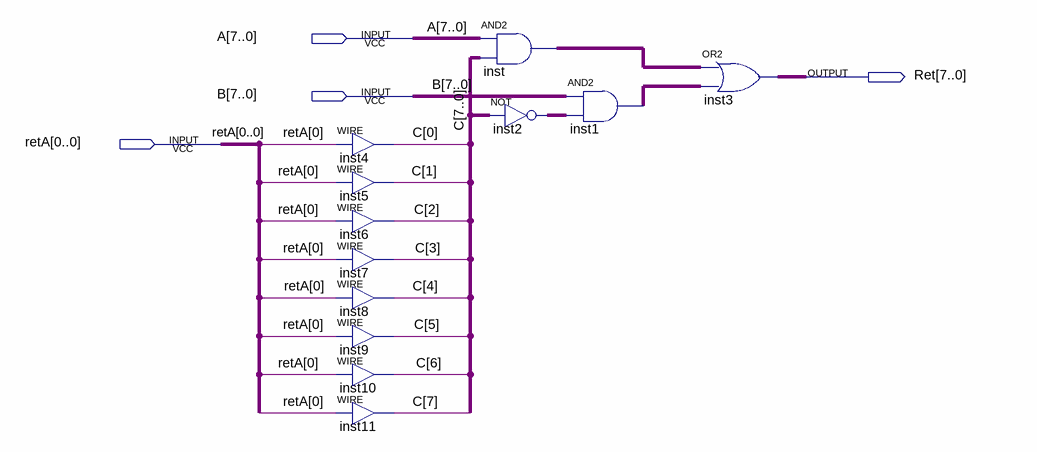
[diagram p0: schematic sheet]
// Quartus schematic multiplex_8.bdf as structural Verilog: 12 symbols, 4 pins
module multiplex_8 (
  input  [7:0] A,
  input  [7:0] B,
  input  [0:0] retA,
  output [7:0] Ret
);

  wire [7:0] C, inst1_out, inst2_out, inst_out;

  assign C[0] = retA[0];  // WIRE inst4
  assign C[1] = retA[0];  // WIRE inst5
  assign C[2] = retA[0];  // WIRE inst6
  assign C[3] = retA[0];  // WIRE inst7
  assign C[4] = retA[0];  // WIRE inst8
  assign C[5] = retA[0];  // WIRE inst9
  assign C[6] = retA[0];  // WIRE inst10
  assign C[7] = retA[0];  // WIRE inst11
  assign inst_out = A & C;  // AND2 inst, 8 bits wide
  assign inst2_out = ~C;  // NOT inst2, 8 bits wide
  assign inst1_out = B & inst2_out;  // AND2 inst1, 8 bits wide
  assign Ret = inst_out | inst1_out;  // OR2 inst3, 8 bits wide
endmodule
